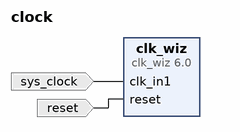
[diagram p0: block diagram of the top level]
# Vivado block design clock, xc7a35tcpg236-1, Vivado 2020.1
create_bd_design clock

create_bd_port -dir I -type clk sys_clock
set_property -dict {CONFIG.FREQ_HZ 100000000 CONFIG.PHASE 0.000} [get_bd_ports sys_clock]
create_bd_port -dir I -type rst reset
set_property -dict {CONFIG.POLARITY ACTIVE_HIGH} [get_bd_ports reset]

create_bd_cell -type ip -vlnv xilinx.com:ip:clk_wiz:6.0 clk_wiz
set_property -dict [list \
  CONFIG.CLKOUT1_JITTER 151.636 \
  CONFIG.CLKOUT1_REQUESTED_OUT_FREQ 50.000 \
  CONFIG.CLK_IN1_BOARD_INTERFACE sys_clock \
  CONFIG.MMCM_CLKOUT0_DIVIDE_F 20.000 \
  CONFIG.RESET_BOARD_INTERFACE reset \
  CONFIG.USE_BOARD_FLOW true \
] [get_bd_cells clk_wiz]

# ---- connections ----

connect_bd_net [get_bd_ports sys_clock] [get_bd_pins clk_wiz/clk_in1]
connect_bd_net [get_bd_ports reset] [get_bd_pins clk_wiz/reset]

validate_bd_design
save_bd_design
